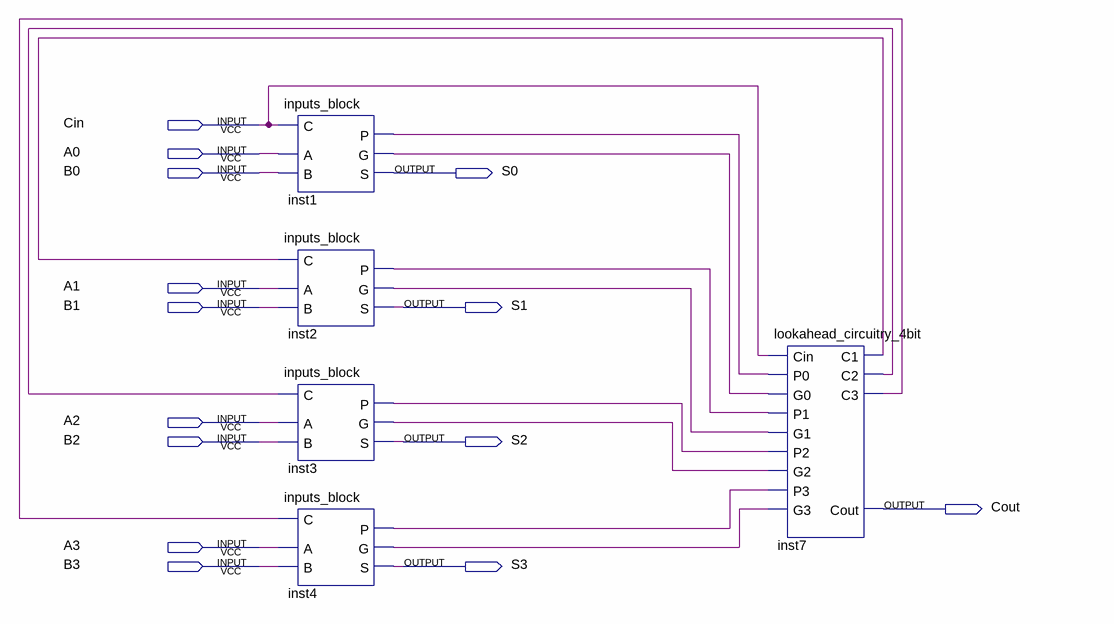
[diagram p0: schematic sheet]
// Quartus schematic 4_bit_CLA.bdf as structural Verilog: 5 symbols, 14 pins
module \4_bit_CLA  (
  input  Cin,
  input  A0,
  input  B0,
  input  A1,
  input  B1,
  input  A2,
  input  B2,
  input  A3,
  input  B3,
  output S0,
  output S1,
  output S2,
  output Cout,
  output S3
);

  wire inst1_g, inst1_p, inst2_g, inst2_p, inst3_g, inst3_p, inst4_g, inst4_p, inst7_c1, inst7_c2, inst7_c3;

  inputs_block inst1 (.A(A0), .B(B0), .C(Cin), .G(inst1_g), .P(inst1_p), .S(S0));
  inputs_block inst2 (.A(A1), .B(B1), .C(inst7_c1), .G(inst2_g), .P(inst2_p), .S(S1));
  inputs_block inst3 (.A(A2), .B(B2), .C(inst7_c2), .G(inst3_g), .P(inst3_p), .S(S2));
  inputs_block inst4 (.A(A3), .B(B3), .C(inst7_c3), .G(inst4_g), .P(inst4_p), .S(S3));
  lookahead_circuitry_4bit inst7 (
    .P0(inst1_p), .G0(inst1_g), .P1(inst2_p), .G1(inst2_g), .P2(inst3_p), .G2(inst3_g), .P3(inst4_p),
    .G3(inst4_g), .Cin(Cin), .Cout(Cout), .C1(inst7_c1), .C2(inst7_c2), .C3(inst7_c3));
endmodule
